# Altium schematic sheet TPS61088RHLR.schdoc
size 60 x 73 mm
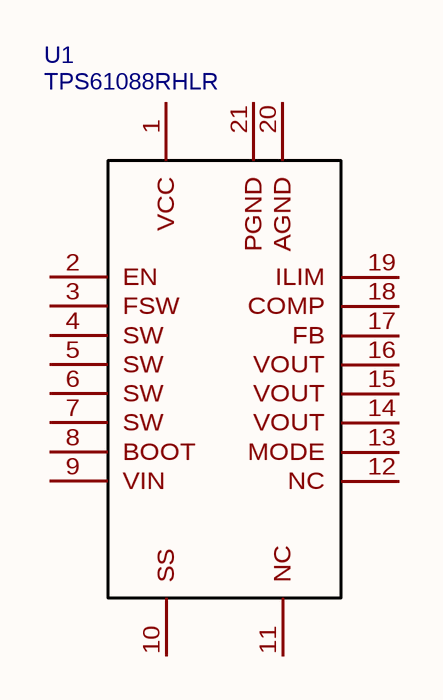
[diagram p0: TPS61088RHLR.schdoc]

## Parts
U1  TPS61088RHLR  [VQFN-20_L4.6-W3.6-P0.50-BL]

## Nets

Not connected (* = marked no-connect by the designer): U1 1(VCC) 2(EN) 3(FSW) 4(SW) 5(SW) 6(SW) 7(SW) 8(BOOT) 9(VIN) 10(SS) 11(NC) 12(NC) 13(MODE) 14(VOUT) 15(VOUT) 16(VOUT) 17(FB) 18(COMP) 19(ILIM) 20(AGND) 21(PGND)

## Library data of the parts
U1 = TPS61088RHLR: BOM_Manufacturer: TI; SMT Type: Extend; BOM_Supplier: LCSC; BOM_Manufacturer Part: TPS61088RHLR; BOM_Supplier Part: C87357; BOM_LCSC Assembly: Yes; spicePre: U; spiceSymbolName: TPS61088RHLR